# Altium project Display Segmental LCD118x1 DF700543-05 Backlights RGBW.PrjPCB
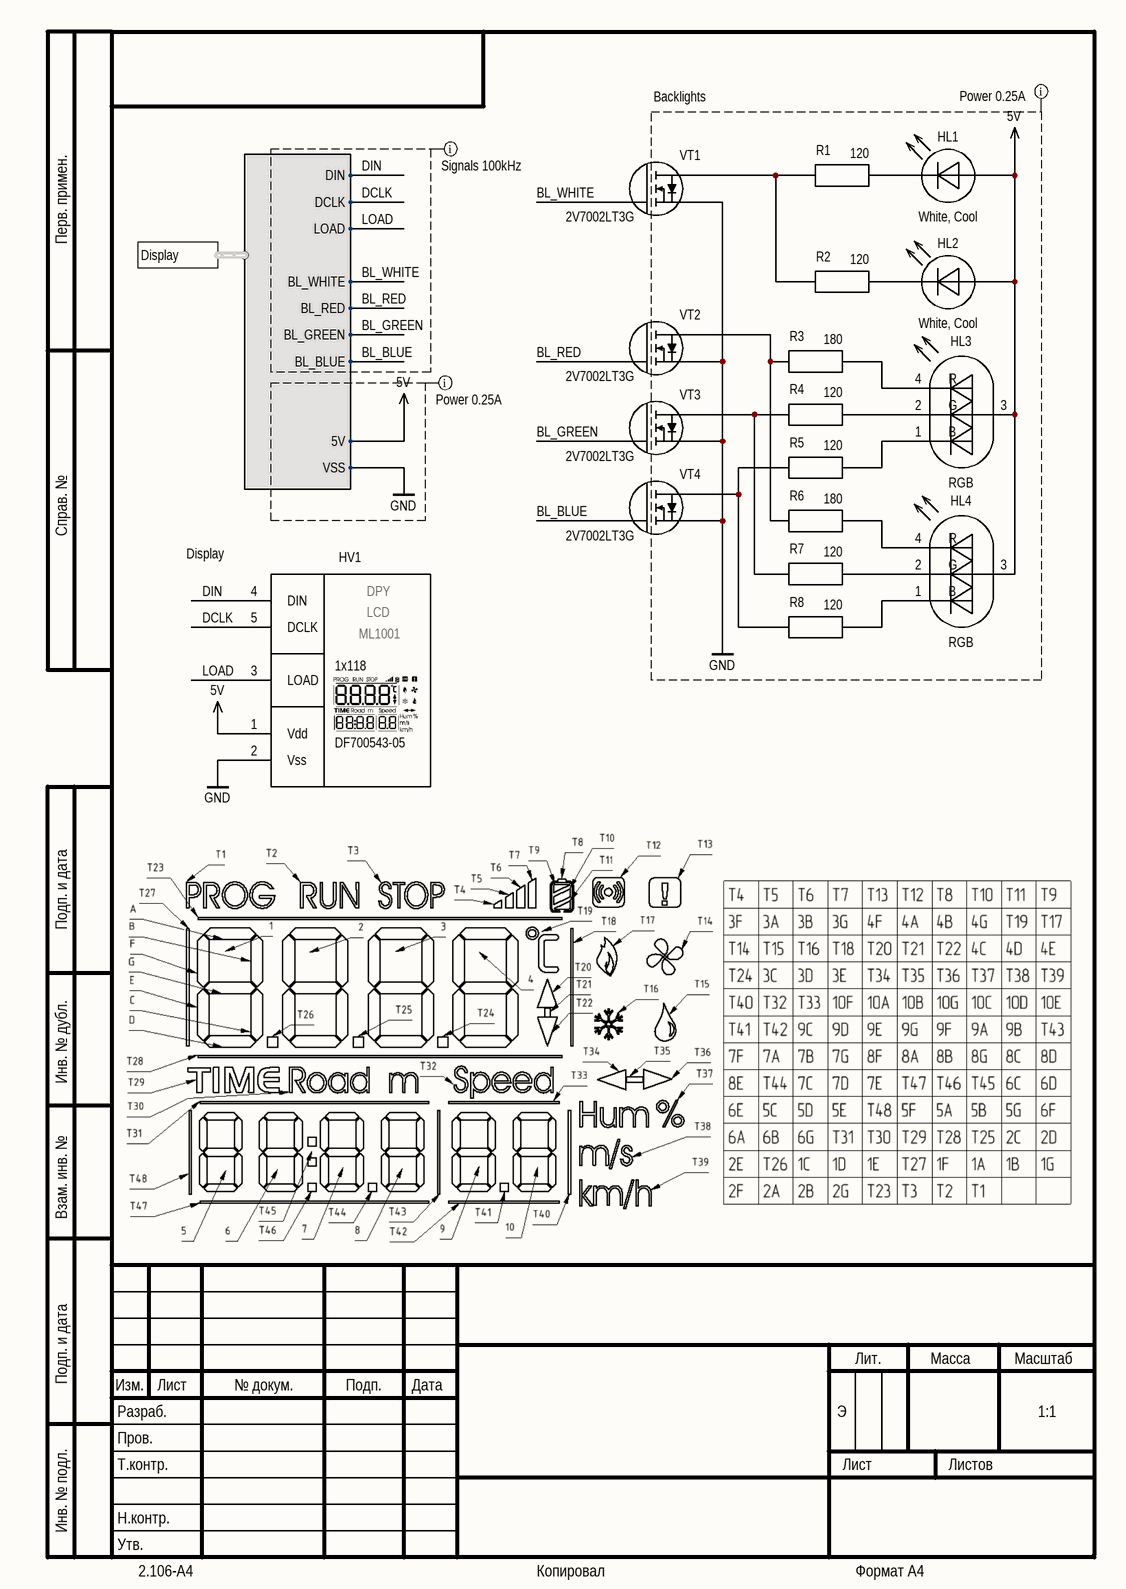
[diagram p0: Display Segmental LCD118x1 DF700543-05 Backlights RGBW.SchDoc]
1 sheet, 17 parts. Net scope: flat (ports and power ports of the same name join across sheets).
Board file: Display Segmental LCD118x1 DF700543-05 Backlights RGBW.PcbDoc

## Sheet Display Segmental LCD118x1 DF700543-05 Backlights RGBW.SchDoc
size 209 x 297 mm; Scale: 1:1; Letter1Column: Э

### Parts
HL1  White, Cool  [LED 3216 RA]
HL2  White, Cool  [LED 3216 RA]
HL3  RGB  [LED RGB 3216 RA]
HL4  RGB  [LED RGB 3216 RA]
HV1  DF700543-05  [DISP SEG LCD128 DF700543-05]
R1  120  [RESC1608M]
R2  120  [RESC1608M]
R3  180  [RESC1608M]
R4  120  [RESC1608M]
R5  120  [RESC1608M]
R6  180  [RESC1608M]
R7  120  [RESC1608M]
R8  120  [RESC1608M]
VT1  2V7002LT3G  [SOT-23-3M]
VT2  2V7002LT3G  [SOT-23-3M]
VT3  2V7002LT3G  [SOT-23-3M]
VT4  2V7002LT3G  [SOT-23-3M]

### Ports
Display (harness Display)

### Harnesses
Display: DIN, DCLK, LOAD, 5V, VSS, BL_WHITE, BL_RED, BL_GREEN, BL_BLUE

### Nets
5V: HL1.1(Anode) HL2.1(Anode) HL3.3(CA) HL4.3(CA) HV1.1(Vdd) ; port Display.5V
GND: HV1.2(Vss) VT1.2(Source) VT2.2(Source) VT3.2(Source) VT4.2(Source) ; port Display.VSS
BL_BLUE: VT4.1(Gate) ; port Display.BL_BLUE
BL_GREEN: VT3.1(Gate) ; port Display.BL_GREEN
BL_RED: VT2.1(Gate) ; port Display.BL_RED
BL_WHITE: VT1.1(Gate) ; port Display.BL_WHITE
DCLK: HV1.5(DCLK) ; port Display.DCLK
DIN: HV1.4(DIN) ; port Display.DIN
LOAD: HV1.3(LOAD) ; port Display.LOAD
NetHL1_2: HL1.2(Cathode) R1.2
NetHL2_2: HL2.2(Cathode) R2.2
NetHL3_1: HL3.1(BLUE) R5.2
NetHL3_2: HL3.2(GREEN) R4.2
NetHL3_4: HL3.4(RED) R3.2
NetHL4_1: HL4.1(BLUE) R8.2
NetHL4_2: HL4.2(GREEN) R7.2
NetHL4_4: HL4.4(RED) R6.2
NetR1_1: R1.1 R2.1 VT1.3(Drain)
NetR3_1: R3.1 R6.1 VT2.3(Drain)
NetR4_1: R4.1 R7.1 VT3.3(Drain)
NetR5_1: R5.1 R8.1 VT4.3(Drain)

### Layout directives
net class Signals 100kHz; rule Width Constraint [Pref Width = 0.25mm    Min Width = 0.1mm    Max Width = 0.5mm]; rule Clearance Constraint [Clearance = 0.2mm]; rule Routing Via Style [Pref Size = 1.1mm    Pref Hole Size = 0.5mm]: BL_BLUE, BL_GREEN, BL_RED, BL_WHITE, DCLK, DIN, LOAD
net class Power 0.25A; rule Width Constraint [Pref Width = 0.3mm    Min Width = 0.2mm    Max Width = 0.5mm]; rule Clearance Constraint [Clearance = 0.3mm]; rule Routing Via Style [Pref Size = 1.1mm    Pref Hole Size = 0.6mm]: 5V, GND

### Notes on the sheet
- Backlights
- (near HV1) Display
- Перв. примен.
- Справ. №
- Подп. и дата
- Инв. № дубл.
- Взам. инв. №
- Разраб.
- Изм.
- Лист
- № докум.
- Подп.
- Дата
- Лит.
- Масса
- Масштаб
- Пров.
- Т.контр.
- Листов
- Инв. № подл.
- Утв.
- Н.контр.
- 2.106-A4
- Копировал
- Формат А4
- (in symbol DF700543-05) DPY; LCD; 1x118
- (in symbol HQ12-2353RGBC) R; G; B

### Library data of the parts
HL1 HL2 = HQ12-2152UWC: LED White 1206(3216) RA; Manufacturer: Harvatek; Group: Discrete - LED; Forward Current: 20mA; Forward Voltage: 3.1V; Package: 1206 (3216) RA; Part name: HQ12-2152UWC; Color: White, Cool; Operating Temperature: -40°C +85°C; Mounting Type: Surface Mount, Right Angle; Dimension: 3.20mm x 1.50mm; Thickness: 1.00mm
HL3 HL4 = HQ12-2353RGBC: LED RGB 1206(3216) RA CA; Manufacturer: Harvatek; Group: Discrete - LED; Forward Current: 25mA; Forward Voltage: R 2.1V, G 2.7V, B 2.9V; Wavelength: R 625nm, G 528nm, B 470nm; Package: 1206 (3216) RA; Part name: HQ12-2353RGBC; Color: RGB; Operating Temperature: -30°C +85°C; Mounting Type: Surface Mount, Right Angle; Dimension: 3.20mm x 1.40mm; Thickness: 1.00mm
HV1 = DF700543-05: Display Segmental LCD128 Special; Group: Digital - Displays -  Segmental; Forward current: 50mA; Driver: ML1001; Package: DF700543-05; Part name: DF700543-05; Color: Black; Dimension: 48.53mm x 41.00mm; Thickness: 6.00mm; Operating Temperature: -40°C +85°C; Mounting Type: Through Hole
R1 R2 R4 R5 R7 R8 = RC0603JR-07120RL: RESC 120 0603(1608); Manufacturer: Yageo; Group: Discrete - Resistors - Ceramic; Temperature Coefficient: ±100ppm/°C; Tolerance: ±5%; Power: 0.1W; Part name: RC0603JR-07120RL; Type: Thin Film; Package: 0603 (1608); Value: 120; Dimension: 1.60mm x 0.80mm; Thickness: 0.55mm; Operating Temperature: -55°C +155°C; Mounting Type: Surface Mount
R3 R6 = RC0603JR-07180RL: RESC 180 0603(1608); Manufacturer: Yageo; Group: Discrete - Resistors - Ceramic; Temperature Coefficient: ±100ppm/°C; Tolerance: ±5%; Power: 0.1W; Part name: RC0603JR-07180RL; Type: Thin Film; Package: 0603 (1608); Value: 180; Dimension: 1.60mm x 0.80mm; Thickness: 0.55mm; Operating Temperature: -55°C +155°C; Mounting Type: Surface Mount
VT1-VT4 = 2V7002LT3G: MOSFET N 0.1A 60V; Manufacturer: ON Semiconductor; Group: Discrete - Transistors - FET; Drain Current: 115mA; Gate-Source Voltage: ±20V; Power Dissipation: 225mW; Drain-Source ON-Resistance: 7.5 Ohm; FET Type: N-Channel; Part name: 2V7002LT3G; Package: SOT-23; Drain-Source Voltage: 60V; Thickness: 1.00mm; Dimension: 2.90mm x 2.80mm; Operating Temperature: -55°C +150°C; Mounting Type: Surface Mount